# Altium project Float_Power_PCB.PrjPcb
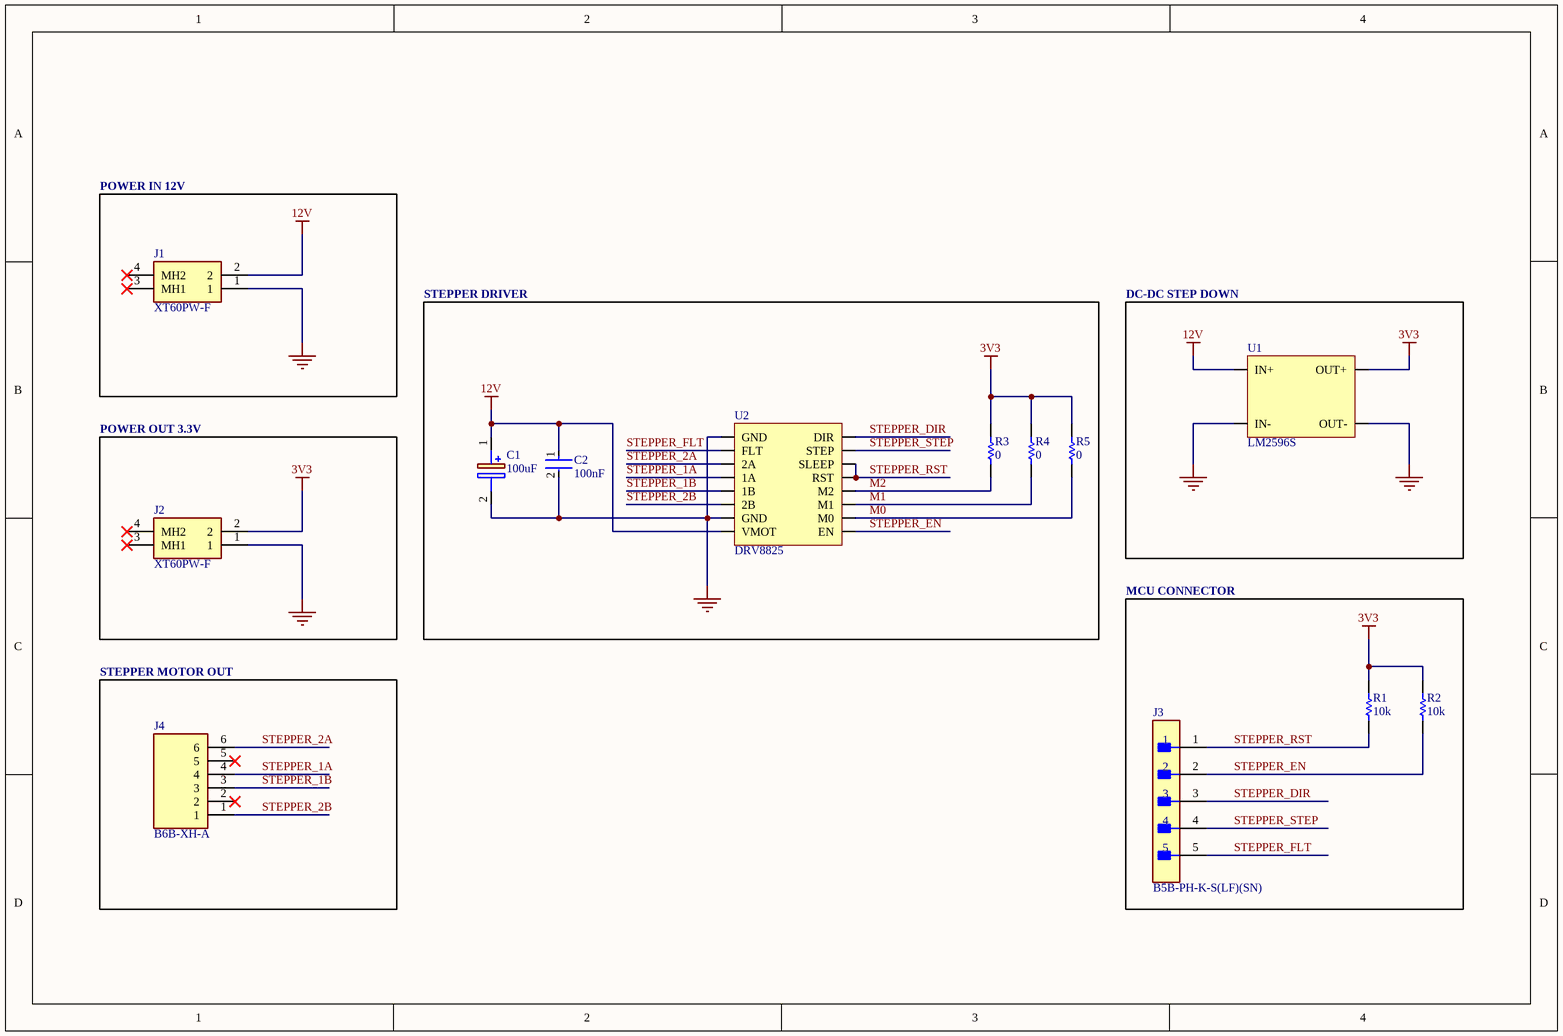
[diagram p0: Float_Power_PCB.SchDoc]
1 sheet, 13 parts. Net scope: global (net labels, ports and power ports of the same name join across sheets).
Board file: Float_Power_PCB.PcbDoc

## Sheet Float_Power_PCB.SchDoc
size A4; SheetNumber: 1; SheetTotal: 1

### Parts
C1  100uF  [EEHZA1E101XP]
C2  100nF  [FP-0805-L_2_01_0_2-W_1_25-MFG]
J1  XT60PW-F  [XT60PWF]
J2  XT60PW-F  [XT60PWF]
J3  B5B-PH-K-S(LF)(SN)  [FP-B5B-PH-K-S_LF_SN-MFG]
J4  B6B-XH-A  [B6BXHA]
R1  10k  [RESC2013X60X35ML10T20]
R2  10k  [RESC2013X60X35ML10T20]
R3  0  [RESC2013X60X35ML10T20]
R4  0  [RESC2013X60X35ML10T20]
R5  0  [RESC2013X60X35ML10T20]
U1  LM2596S  [LM2596S]
U2  DRV8825  [DRV8825]

### Blocks framed on the sheet
POWER IN 12V: J1
STEPPER DRIVER: C1 C2 R3-R5 U2
DC-DC STEP DOWN: U1
POWER OUT 3.3V: J2
MCU CONNECTOR: J3 R1 R2
STEPPER MOTOR OUT: J4

### Nets
3V3: J2.2 R1.2 R2.2 R3.1 R4.2 R5.2 U1.OUT+
12V: C1.1(+) C2.1 J1.2 U1.IN+ U2.VMOT
GND: C1.2(-) C2.2 J1.1 J2.1 U1.IN- U1.OUT- U2.GND
M0: R5.1 U2.M0
M1: R4.1 U2.M1
M2: R3.2 U2.M2
STEPPER_1A: J4.4 U2.1A
STEPPER_1B: J4.3 U2.1B
STEPPER_2A: J4.6 U2.2A
STEPPER_2B: J4.1 U2.2B
STEPPER_DIR: J3.3 U2.DIR
STEPPER_EN: J3.2 R2.1 U2.EN
STEPPER_FLT: J3.5 U2.FLT
STEPPER_RST: J3.1 R1.1 U2.RST U2.SLEEP
STEPPER_STEP: J3.4 U2.STEP

Not connected (* = marked no-connect by the designer): J1 3(MH1)* 4(MH2)*; J2 3(MH1)* 4(MH2)*; J4 2* 5*

### Library data of the parts
C1 = EEHZA1E101XP: Capacitor Polarised; Manufacturer_Name: Panasonic; Datasheet Link: http://industrial.panasonic.com/cdbs/www-data/pdf/RDD0000/ABA0000C1221.pdf; Height: 8.3mm; Manufacturer_Part_Number: EEHZA1E101XP; Arrow Part Number: EEHZA1E101XP; Arrow Price/Stock: https://www.arrow.com/en/products/eehza1e101xp/panasonic?utm_currency=USD&region=nac
C2 = CMP-1036-04738-3: Voltage Rating: 10V; Tolerance: 10%; Capacitance: 100n; Dissipation Factor: 5%; Dielectric: X7R; Insulation Resistance: 100GR; RoHS Compliant: Yes; Case/Package: 0805; Termination: SMD/SMT; Contact Plating: Tin; Package Quantity: 1; Packaging: Tape and Reel; Series: -; Depth: 1.25mm; Number of Pins: 2; Construction: Flat; Mount: Surface Mount; Voltage: 10V; Radiation Hardening: No; Case Code (Metric): 2012; Case Code (Imperial): 0805; Height: 1.4mm; Thickness: 0.055inch; REACH SVHC: No SVHC; Size: 1.4mm; Max Operating Temperature: 125°C; Lead Free: Lead Free; Length: 2.01mm; Voltage Rating (DC): 10V; Min Operating Temperature: -55°C; Width: 1.25mm
J1 J2 = XT60PW-F: Connector; Manufacturer_Name: Amass; Datasheet Link: https://www.tme.eu/Document/1191bc2fa3aee3c446e5a895fd8f7983/XT60PW-F.pdf; Height: 8.4mm; Manufacturer_Part_Number: XT60PW-F
J3 = CMP-2000-05908-2: CONN HEADER VERT 5POS 2MM; Voltage Rating (AC): 100V; Number of Positions: 5; Contact Resistance: 20mR; Insulation Resistance: 1MR; Current Rating: 2A; Gender: Male; Mated Stacking Heights: 8mm; Series: PH; Number of Poles: 5; Width: 4.5mm; Insulation Color: Natural; Fastening Type: Detent; Flammability Rating: UL94 V-0; Mount: Through Hole; Lead Free: Lead Free; Number of Rows: 1; REACH SVHC: No SVHC; Max Voltage Rating (AC): 100V; Contact Mating Length: 0.13inch; Contact Plating: Tin; Housing Material: Polyamide; Depth: 4.5mm; Contact Type: Male Pin; Voltage Rating: 100V; Color: Natural; Housing Color: White; Lead Pitch: 2mm; Number of Contacts: 5; Orientation: Straight; Packaging: Bulk; Contact Material: Brass; Pitch: 2mm; Insulation Material: Nylon; Connector Type: Header; Contact Finish - Mating: TIN; Termination: Solder; Number of Pins: 5; Length: 11.9mm; Contact Shape: Square; Max Current Rating: 2A; Working Voltage: 100V; Min Operating Temperature: -25°C; Max Operating Temperature: 85°C; Material: Polyamide; Height: 9.4mm
J4 = B6B-XH-A: Connector; Manufacturer_Name: JST (JAPAN SOLDERLESS TERMINALS); Datasheet Link: https://www.jst.com/wp-content/uploads/2021/01/eXH-new.pdf; Height: 7mm; Manufacturer_Part_Number: B6B-XH-A
R1-R5 = CMP-2100-03671-1: Manufacturer: Yageo; Temperature Coefficient: 100ppm/degreesC; Voltage Rating (DC): 150V; Max Power Dissipation: 125mW; Resistance: 1KOhm; Tolerance: 1%; Number of Pins: 2; Number of Terminations: 2; Datasheet URL: http://www.yageo.com/NewPortal/yageodocoutput?fileName=/pdf/R-Chip/PYu-RC_Group_51_RoHS_L_5.pdf; Length: 0.079inch; Package Description: 2-Pin Surface Mounted Device, Body 2 x 1.25 mm; Depth: 1.25mm; Height: 0.024inch; Military Standard: Not; Case/Package: 0805; Package Reference: 0805; RoHSCompliant: true; Lead Free: LeadFree; Packaging: TapeandReel; Package Quantity: 1; Datasheet Version: Rev. 5, 10/2016; Min Operating Temperature: -55degC; Voltage Rating: 150V; Composition: ThickFilm; Case Code (Imperial): 0805; Power Rating: 125mW; Width: 0.049inch; Case Code (Metric): 2012; Manufacturer URL: http://www.yageo.com/; Max Operating Temperature: 155degC; REACH SVHC: Unknown; Termination: SMD/SMT
U1 = LM2596S: LM2596S DC-DC Buck Converter: step-down voltage regulator, 3A max, 1.23–37V output
U2 = DRV8825: DRV8825 stepper motor driver module